# EAGLE design PWMpowctrl (EAGLE 8.6.0)

## Sheet 1 of 2: DRIVERS
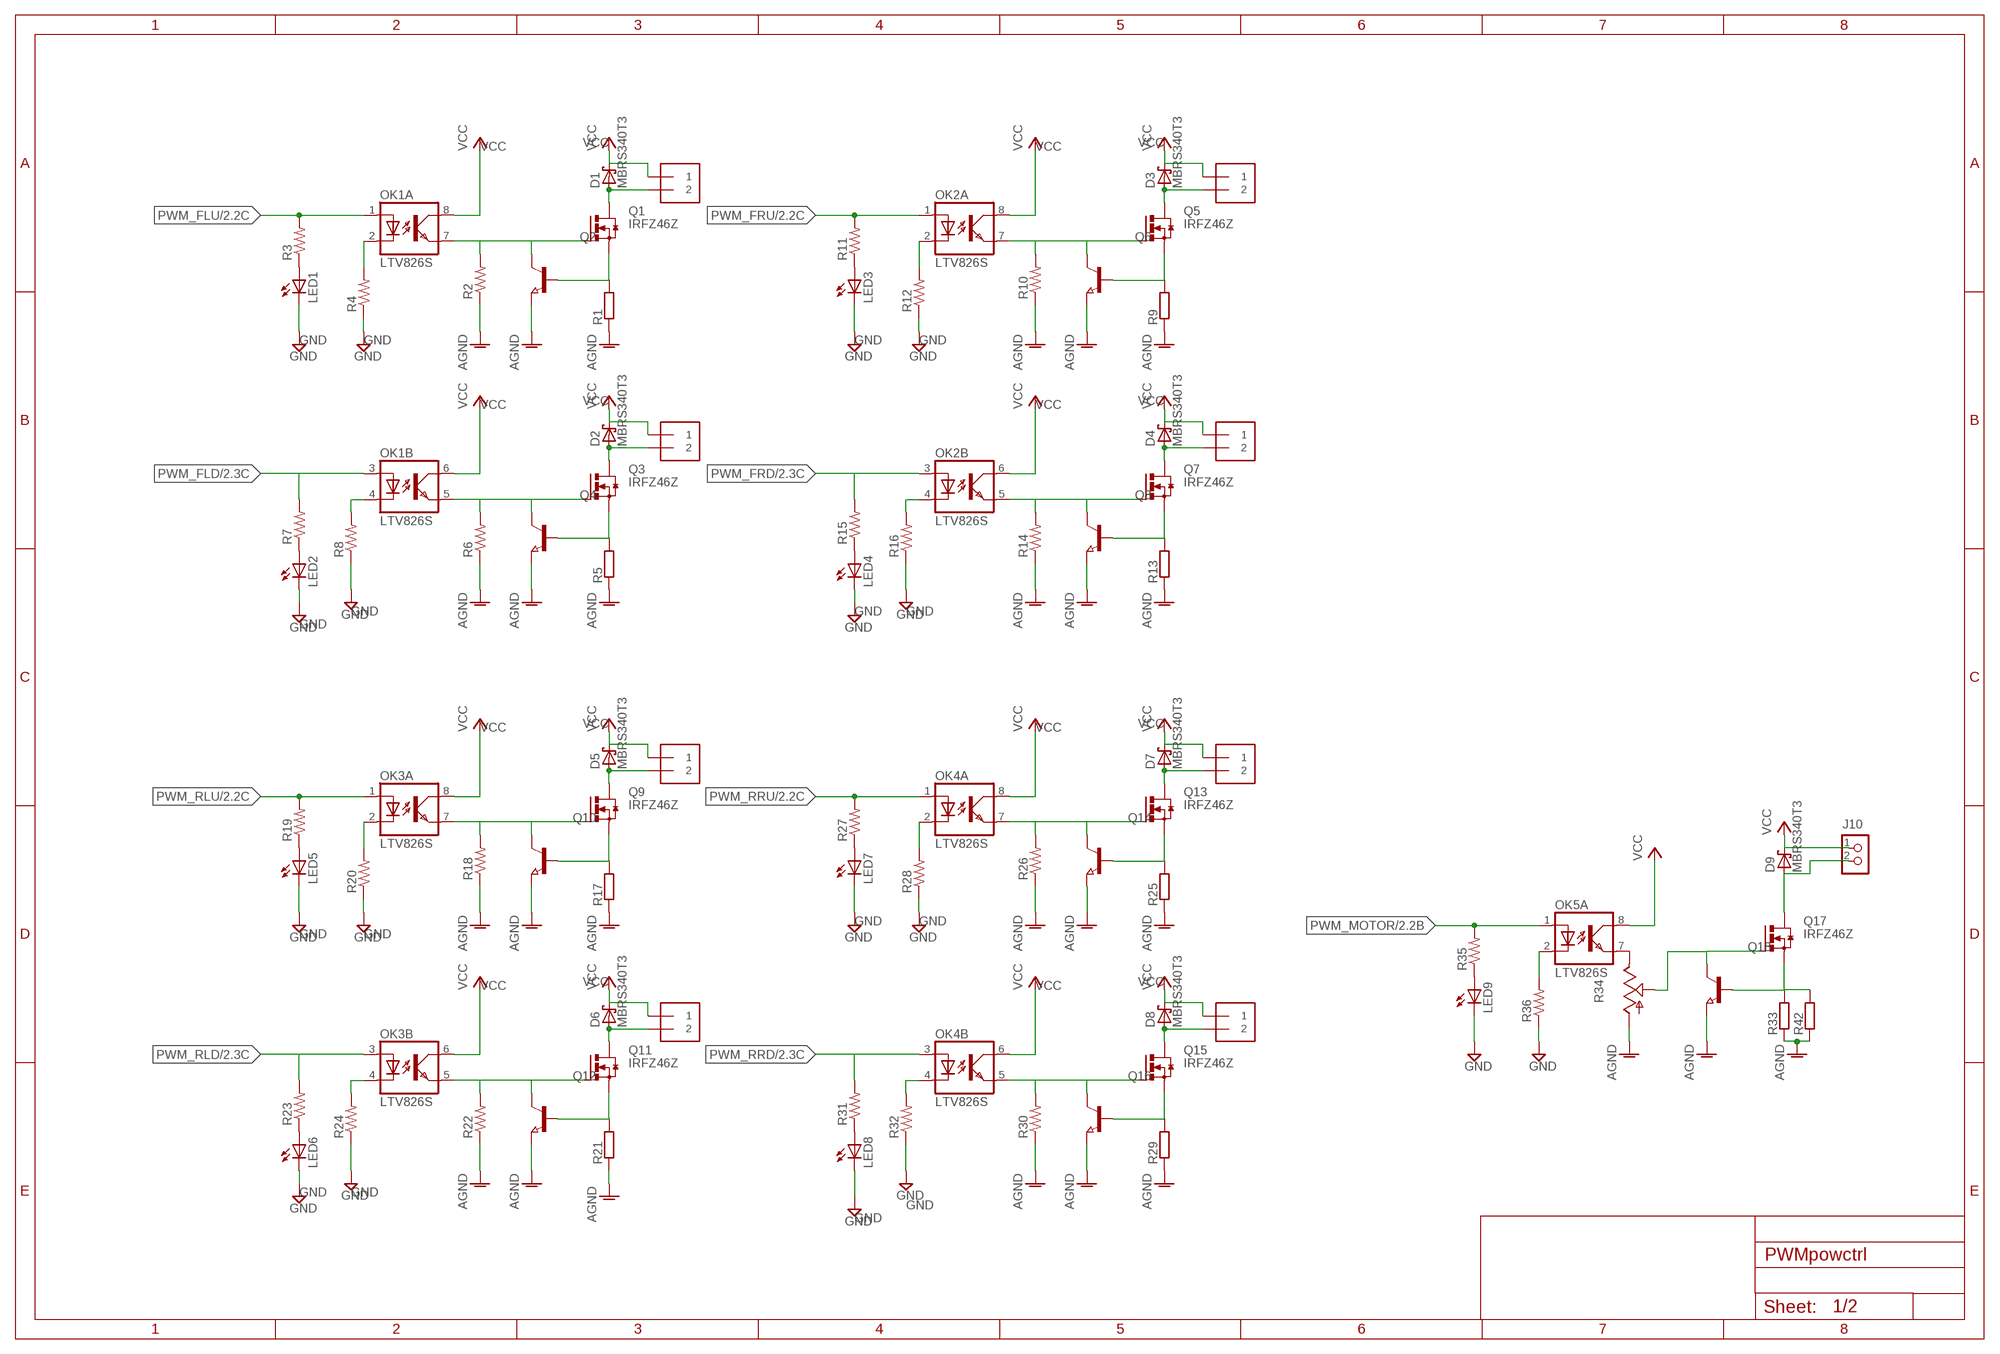
[diagram p0: schematic, sheet 1]

### Parts
D1  MBRS340T3  [SMC]
D2  MBRS340T3  [SMC]
D3  MBRS340T3  [SMC]
D4  MBRS340T3  [SMC]
D5  MBRS340T3  [SMC]
D6  MBRS340T3  [SMC]
D7  MBRS340T3  [SMC]
D8  MBRS340T3  [SMC]
D9  MBRS340T3  [SMC]
J1  1X2-3.5MM  [3.5MMTERM]
J2  1X2-3.5MM  [3.5MMTERM]
J3  1X2-3.5MM  [3.5MMTERM]
J4  1X2-3.5MM  [3.5MMTERM]
J5  1X2-3.5MM  [3.5MMTERM]
J6  1X2-3.5MM  [3.5MMTERM]
J7  1X2-3.5MM  [3.5MMTERM]
J8  1X2-3.5MM  [3.5MMTERM]
J10  CON_TERMINAL_BLOCK_02-5MM  [TERMINAL_BLOCK_2P_5]
LED1  LED3MM  [LED3MM]
LED2  LED3MM  [LED3MM]
LED3  LED3MM  [LED3MM]
LED4  LED3MM  [LED3MM]
LED5  LED3MM  [LED3MM]
LED6  LED3MM  [LED3MM]
LED7  LED3MM  [LED3MM]
LED8  LED3MM  [LED3MM]
LED9  LED3MM  [LED3MM]
OK1  LTV826S  [DIL8-SMD]
OK2  LTV826S  [DIL8-SMD]
OK3  LTV826S  [DIL8-SMD]
OK4  LTV826S  [DIL8-SMD]
OK5  LTV826S  [DIL8-SMD]
Q1  IRFZ46Z  [D2PACK]
Q2  NPN-TRANSISTOR_SOT23  [SOT23]
Q3  IRFZ46Z  [D2PACK]
Q4  NPN-TRANSISTOR_SOT23  [SOT23]
Q5  IRFZ46Z  [D2PACK]
Q6  NPN-TRANSISTOR_SOT23  [SOT23]
Q7  IRFZ46Z  [D2PACK]
Q8  NPN-TRANSISTOR_SOT23  [SOT23]
Q9  IRFZ46Z  [D2PACK]
Q10  NPN-TRANSISTOR_SOT23  [SOT23]
Q11  IRFZ46Z  [D2PACK]
Q12  NPN-TRANSISTOR_SOT23  [SOT23]
Q13  IRFZ46Z  [D2PACK]
Q14  NPN-TRANSISTOR_SOT23  [SOT23]
Q15  IRFZ46Z  [D2PACK]
Q16  NPN-TRANSISTOR_SOT23  [SOT23]
Q17  IRFZ46Z  [D2PACK]
Q18  NPN-TRANSISTOR_SOT23  [SOT23]
R1  BVS  [BVS]
R2  R-US_M1206  [M1206]
R3  R-US_M1206  [M1206]
R4  R-US_M1206  [M1206]
R5  BVS  [BVS]
R6  R-US_M1206  [M1206]
R7  R-US_M1206  [M1206]
R8  R-US_M1206  [M1206]
R9  BVS  [BVS]
R10  R-US_M1206  [M1206]
R11  R-US_M1206  [M1206]
R12  R-US_M1206  [M1206]
R13  BVS  [BVS]
R14  R-US_M1206  [M1206]
R15  R-US_M1206  [M1206]
R16  R-US_M1206  [M1206]
R17  BVS  [BVS]
R18  R-US_M1206  [M1206]
R19  R-US_M1206  [M1206]
R20  R-US_M1206  [M1206]
R21  BVS  [BVS]
R22  R-US_M1206  [M1206]
R23  R-US_M1206  [M1206]
R24  R-US_M1206  [M1206]
R25  BVS  [BVS]
R26  R-US_M1206  [M1206]
R27  R-US_M1206  [M1206]
R28  R-US_M1206  [M1206]
R29  BVS  [BVS]
R30  R-US_M1206  [M1206]
R31  R-US_M1206  [M1206]
R32  R-US_M1206  [M1206]
R33  BVS  [BVS]
R34  TRIM_US-CA6V  [CA6V]
R35  R-US_M1206  [M1206]
R36  R-US_M1206  [M1206]
R42  BVS  [BVS]

### Nets
AGND: Q2.2(E) Q4.2(E) Q6.2(E) Q8.2(E) Q10.2(E) Q12.2(E) Q14.2(E) Q16.2(E) Q18.2(E) R1.2 R2.1 R5.2 R6.1 R9.2 R10.1 R13.2 R14.1 R17.2 R18.1 R21.2 R22.1 R25.2 R26.1 R29.2 R30.1 R33.2 R42.2 ; also sheet 2
GND: LED1.K(C) LED2.K(C) LED3.K(C) LED4.K(C) LED5.K(C) LED6.K(C) LED7.K(C) LED8.K(C) LED9.K(C) R4.1 R8.1 R12.1 R16.1 R20.1 R24.1 R28.1 R32.1 R36.1
N$1: Q1.3(S) Q2.1(B) R1.1
N$2: Q17.3(S) Q18.1(B) R33.1 R42.1
N$3: OK1.2(A:C) R4.2
N$4: Q3.3(S) Q4.1(B) R5.1
N$5: OK1.7(A:EMIT) Q1.1(G) Q2.3(C) R2.2
N$6: D1.A J1.2 Q1.2(D)
N$7: OK1.5(B:EMIT) Q3.1(G) Q4.3(C) R6.2
N$8: LED1.A R3.1
N$9: D2.A J2.2 Q3.2(D)
N$10: LED2.A R7.1
N$11: OK1.4(B:C) R8.2
N$12: Q17.1(G) Q18.3(C) R34.S
N$13: Q5.3(S) Q6.1(B) R9.1
N$14: OK2.7(A:EMIT) Q5.1(G) Q6.3(C) R10.2
N$15: D3.A J3.2 Q5.2(D)
N$16: LED3.A R11.1
N$17: D9.A J10.2 Q17.2(D)
N$18: OK2.2(A:C) R12.2
N$19: Q7.3(S) Q8.1(B) R13.1
N$20: OK2.5(B:EMIT) Q7.1(G) Q8.3(C) R14.2
N$21: D4.A J4.2 Q7.2(D)
N$22: LED4.A R15.1
N$23: OK2.4(B:C) R16.2
N$24: LED9.A R35.1
N$25: Q9.3(S) Q10.1(B) R17.1
N$26: OK3.7(A:EMIT) Q9.1(G) Q10.3(C) R18.2
N$27: D5.A J5.2 Q9.2(D)
N$28: LED5.A R19.1
N$29: OK5.2(A:C) R36.2
N$30: OK3.2(A:C) R20.2
N$31: Q11.3(S) Q12.1(B) R21.1
N$32: OK3.5(B:EMIT) Q11.1(G) Q12.3(C) R22.2
N$33: D6.A J6.2 Q11.2(D)
N$34: LED6.A R23.1
N$35: OK3.4(B:C) R24.2
N$37: Q13.3(S) Q14.1(B) R25.1
N$38: OK4.7(A:EMIT) Q13.1(G) Q14.3(C) R26.2
N$39: D7.A J7.2 Q13.2(D)
N$40: LED7.A R27.1
N$42: OK4.2(A:C) R28.2
N$43: Q15.3(S) Q16.1(B) R29.1
N$44: OK4.5(B:EMIT) Q15.1(G) Q16.3(C) R30.2
N$45: D8.A J8.2 Q15.2(D)
N$46: LED8.A R31.1
N$47: OK4.4(B:C) R32.2
N$53: OK5.7(A:EMIT) R34.E
PWM_FLD: OK1.3(B:A) R7.2 ; also sheet 2
PWM_FLU: OK1.1(A:A) R3.2 ; also sheet 2
PWM_FRD: OK2.3(B:A) R15.2 ; also sheet 2
PWM_FRU: OK2.1(A:A) R11.2 ; also sheet 2
PWM_MOTOR: OK5.1(A:A) R35.2 ; also sheet 2
PWM_RLD: OK3.3(B:A) R23.2 ; also sheet 2
PWM_RLU: OK3.1(A:A) R19.2 ; also sheet 2
PWM_RRD: OK4.3(B:A) R31.2 ; also sheet 2
PWM_RRU: OK4.1(A:A) R27.2 ; also sheet 2
VCC: D1.C D2.C D3.C D4.C D5.C D6.C D7.C D8.C D9.C J1.1 J2.1 J3.1 J4.1 J5.1 J6.1 J7.1 J8.1 J10.1 OK1.6(B:COL) OK1.8(A:COL) OK2.6(B:COL) OK2.8(A:COL) OK3.6(B:COL) OK3.8(A:COL) OK4.6(B:COL) OK4.8(A:COL) OK5.8(A:COL) ; also sheet 2
Unconnected: OK5.3(B:A) OK5.4(B:C) OK5.5(B:EMIT) OK5.6(B:COL) R34.A

## Sheet 2 of 2: INTERFACE & POWER
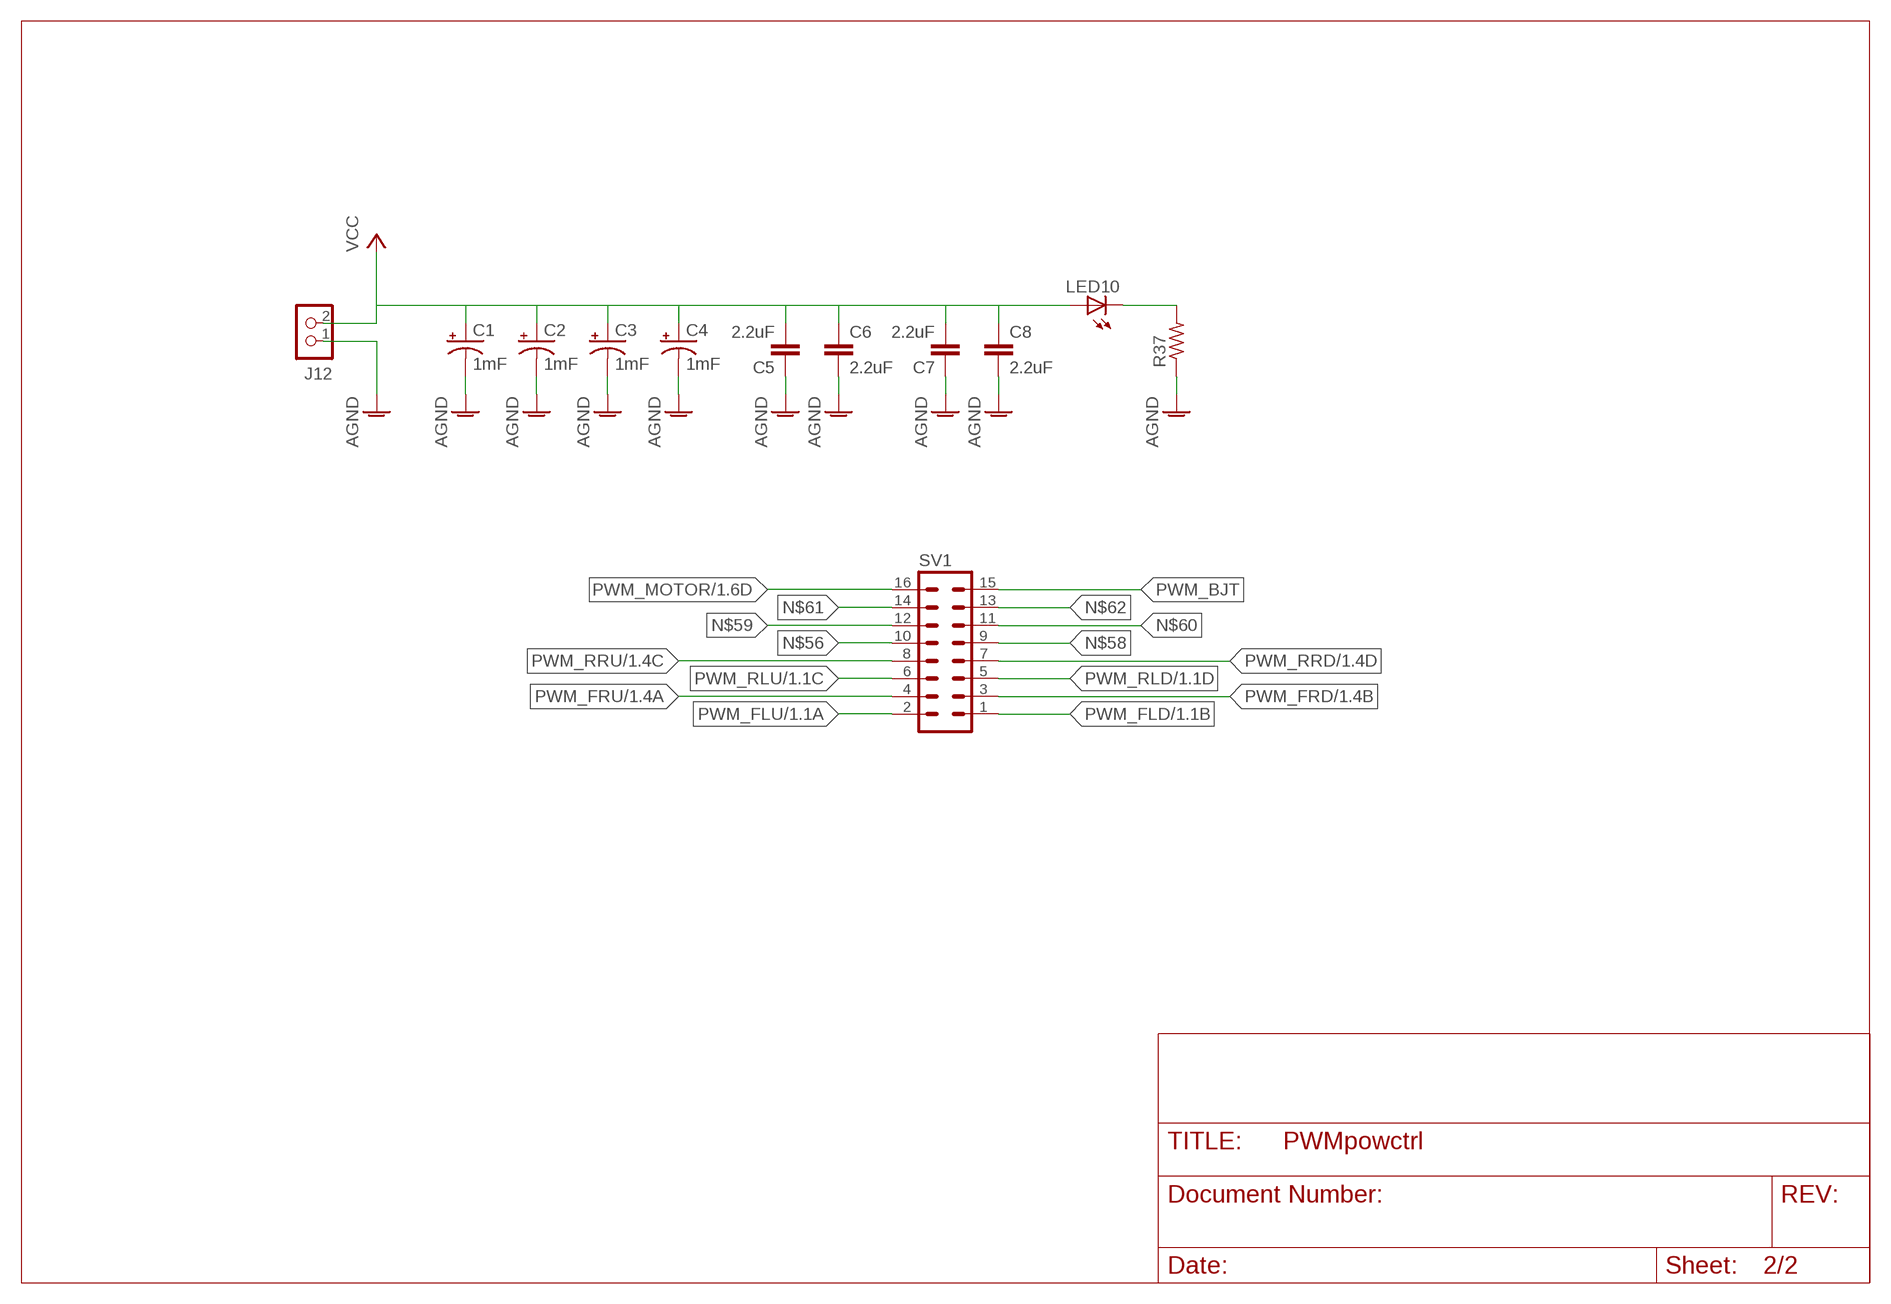
[diagram p1: schematic, sheet 2]

### Parts
C1  1mF  1000UF-RADIAL-5MM-25V-20%  [CPOL-RADIAL-5MM-10MM]
C2  1mF  1000UF-RADIAL-5MM-25V-20%  [CPOL-RADIAL-5MM-10MM]
C3  1mF  1000UF-RADIAL-5MM-25V-20%  [CPOL-RADIAL-5MM-10MM]
C4  1mF  1000UF-RADIAL-5MM-25V-20%  [CPOL-RADIAL-5MM-10MM]
C5  2.2uF  2.2UF-CERCAP-10009  [1206]
C6  2.2uF  2.2UF-CERCAP-10009  [1206]
C7  2.2uF  2.2UF-CERCAP-10009  [1206]
C8  2.2uF  2.2UF-CERCAP-10009  [1206]
J12  CON_TERMINAL_BLOCK_02-5MM  [TERMINAL_BLOCK_2P_5]
LED10  LED5MM  [LED5MM]
R37  R-US_M1206  [M1206]
SV1  MA08-2  [MA08-2]

### Nets
AGND: C1.- C2.- C3.- C4.- C5.1 C6.2 C7.1 C8.2 J12.1 R37.1 ; also sheet 1
N$36: LED10.K(C) R37.2
N$56: SV1.10
N$58: SV1.9
N$59: SV1.12
N$60: SV1.11
N$61: SV1.14
N$62: SV1.13
PWM_BJT: SV1.15
PWM_FLD: SV1.1 ; also sheet 1
PWM_FLU: SV1.2 ; also sheet 1
PWM_FRD: SV1.3 ; also sheet 1
PWM_FRU: SV1.4 ; also sheet 1
PWM_MOTOR: SV1.16 ; also sheet 1
PWM_RLD: SV1.5 ; also sheet 1
PWM_RLU: SV1.6 ; also sheet 1
PWM_RRD: SV1.7 ; also sheet 1
PWM_RRU: SV1.8 ; also sheet 1
VCC: C1.+ C2.+ C3.+ C4.+ C5.2 C6.1 C7.2 C8.1 J12.2 LED10.A ; also sheet 1

## Library data of the parts
C1-C4 = SparkFun-Capacitors:1000UF: 1,000µF/1mF ceramic capacitors A capacitor is a passive two-terminal electrical component used to store electrical energy temporarily in an electric field. CAP-08070; PROD_ID: CAP-09538
C5-C8 = SparkFun-Retired:2.2UF-CER: 2.2uF Ceramic SMT CAP-07888- 10V, 20% (0603) CAP-10009- 50V, 10% (1206); PROD_ID: CAP-10009
D1-D9 = diode:MBRS3*0T3: SCHOTTKY BARRIER RECTIFIER 3.0 AMPERES 20, 30, 40 VOLT Source: MBRS340T3-D.pdf
J1-J8 = adafruit:1X2: 3.5mm Terminal block http://www.ladyada.net/library/pcb/eaglelibrary.html
J10 J12 = dp_devices:CON_TERMINAL_BLOCK_02: 2 poles wire to board terminal block
LED1-LED10 = adafruit:LED: LED OSRAM: - CHIPLED LG R971, LG N971, LY N971, LG Q971, LY Q971, LO R971, LY R971 LH N974, LH R974 LS Q976, LO Q976, LY Q976 LO Q996 - Hyper CHIPLED LW Q18S LB Q993, LB Q99A, LB R99A - SideLED LS A670, LO A670, LY A670, LG A670, LP A670 LB A673, LV A673, LT A673, LW A673 LH A674 LY A675 LS A676, LA A676, LO A676, LY A676, LW A676 LS A679, LY A679, LG A679 - Hyper Micro SIDELED® LS Y876, LA Y876, LO Y876, LY Y876 LT Y87S - SmartLED LW L88C, LW L88S LB L89C, LB L89S, LG L890 LS L89K, LO L89K, LY L89K LS L896, LA L896, LO L896, LY L896 - TOPLED LS T670, LO T670, LY T670, LG T670, LP T670 LSG T670, LSP T670, LSY T670, LOP T670, LYG T670 LG T671, LOG T671, LSG T671 LB T673, LV T673, LT T673, LW T673 LH T674 LS T676, LA T676, LO T676, LY T676, LB T676, LH T676, LSB T676, LW T676 LB T67C, LV T67C, LT T67C, LS T67K, LO T67K, LY T67K, LW E67C LS E67B, LA E67B, LO E67B, LY E67B, LB E67C, LV E67C, LT E67C LW T67C LS T679, LY T679, LG T679 LS T770, LO T770, LY T770, LG T770, LP T770 LB T773, LV T773, LT T773, LW T773 LH T774 LS E675, LA E675, LY E675, LS T675 LS T776, LA T776, LO T776, LY T776, LB T776 LHGB T686 LT T68C, LB T68C - Hyper Mini TOPLED® LB M676 - Mini TOPLED Santana® LG M470 LS M47K, LO M47K, LY M47K Source: http://www.osram.convergy.de/
OK1-OK5 = optocoupler:LTV826: OPTO COUPLER Source: LITEON, LTV816.pdf; OC_FARNELL: unknown; OC_NEWARK: unknown
Q1 Q3 Q5 Q7 Q9 Q11 Q13 Q15 Q17 = transistor-power:IRFZ46Z: AUTOMOTIVE MOSFET Vdss=55V RDSon=13 mOhm ID=51 A
Q2 Q4 Q6 Q8 Q10 Q12 Q14 Q16 Q18 = semicon-smd-ipc:NPN-TRANSISTOR_: NPN TRANSISTOR
R1 R5 R9 R13 R17 R21 R25 R29 R33 R42 = resistor-shunt:BVS: SMD SHUNT RESISTOR; OC_FARNELL: unknown; OC_NEWARK: unknown
R2-R4 R6-R8 R10-R12 R14-R16 R18-R20 R22-R24 R26-R28 R30-R32 R35-R37 = adafruit:R-US_: RESISTOR, American symbol
R34 = pot:TRIM_US-: POTENTIOMETER
SV1 = con-lstb:MA08-2: PIN HEADER; OC_FARNELL: unknown; OC_NEWARK: unknown

## Board
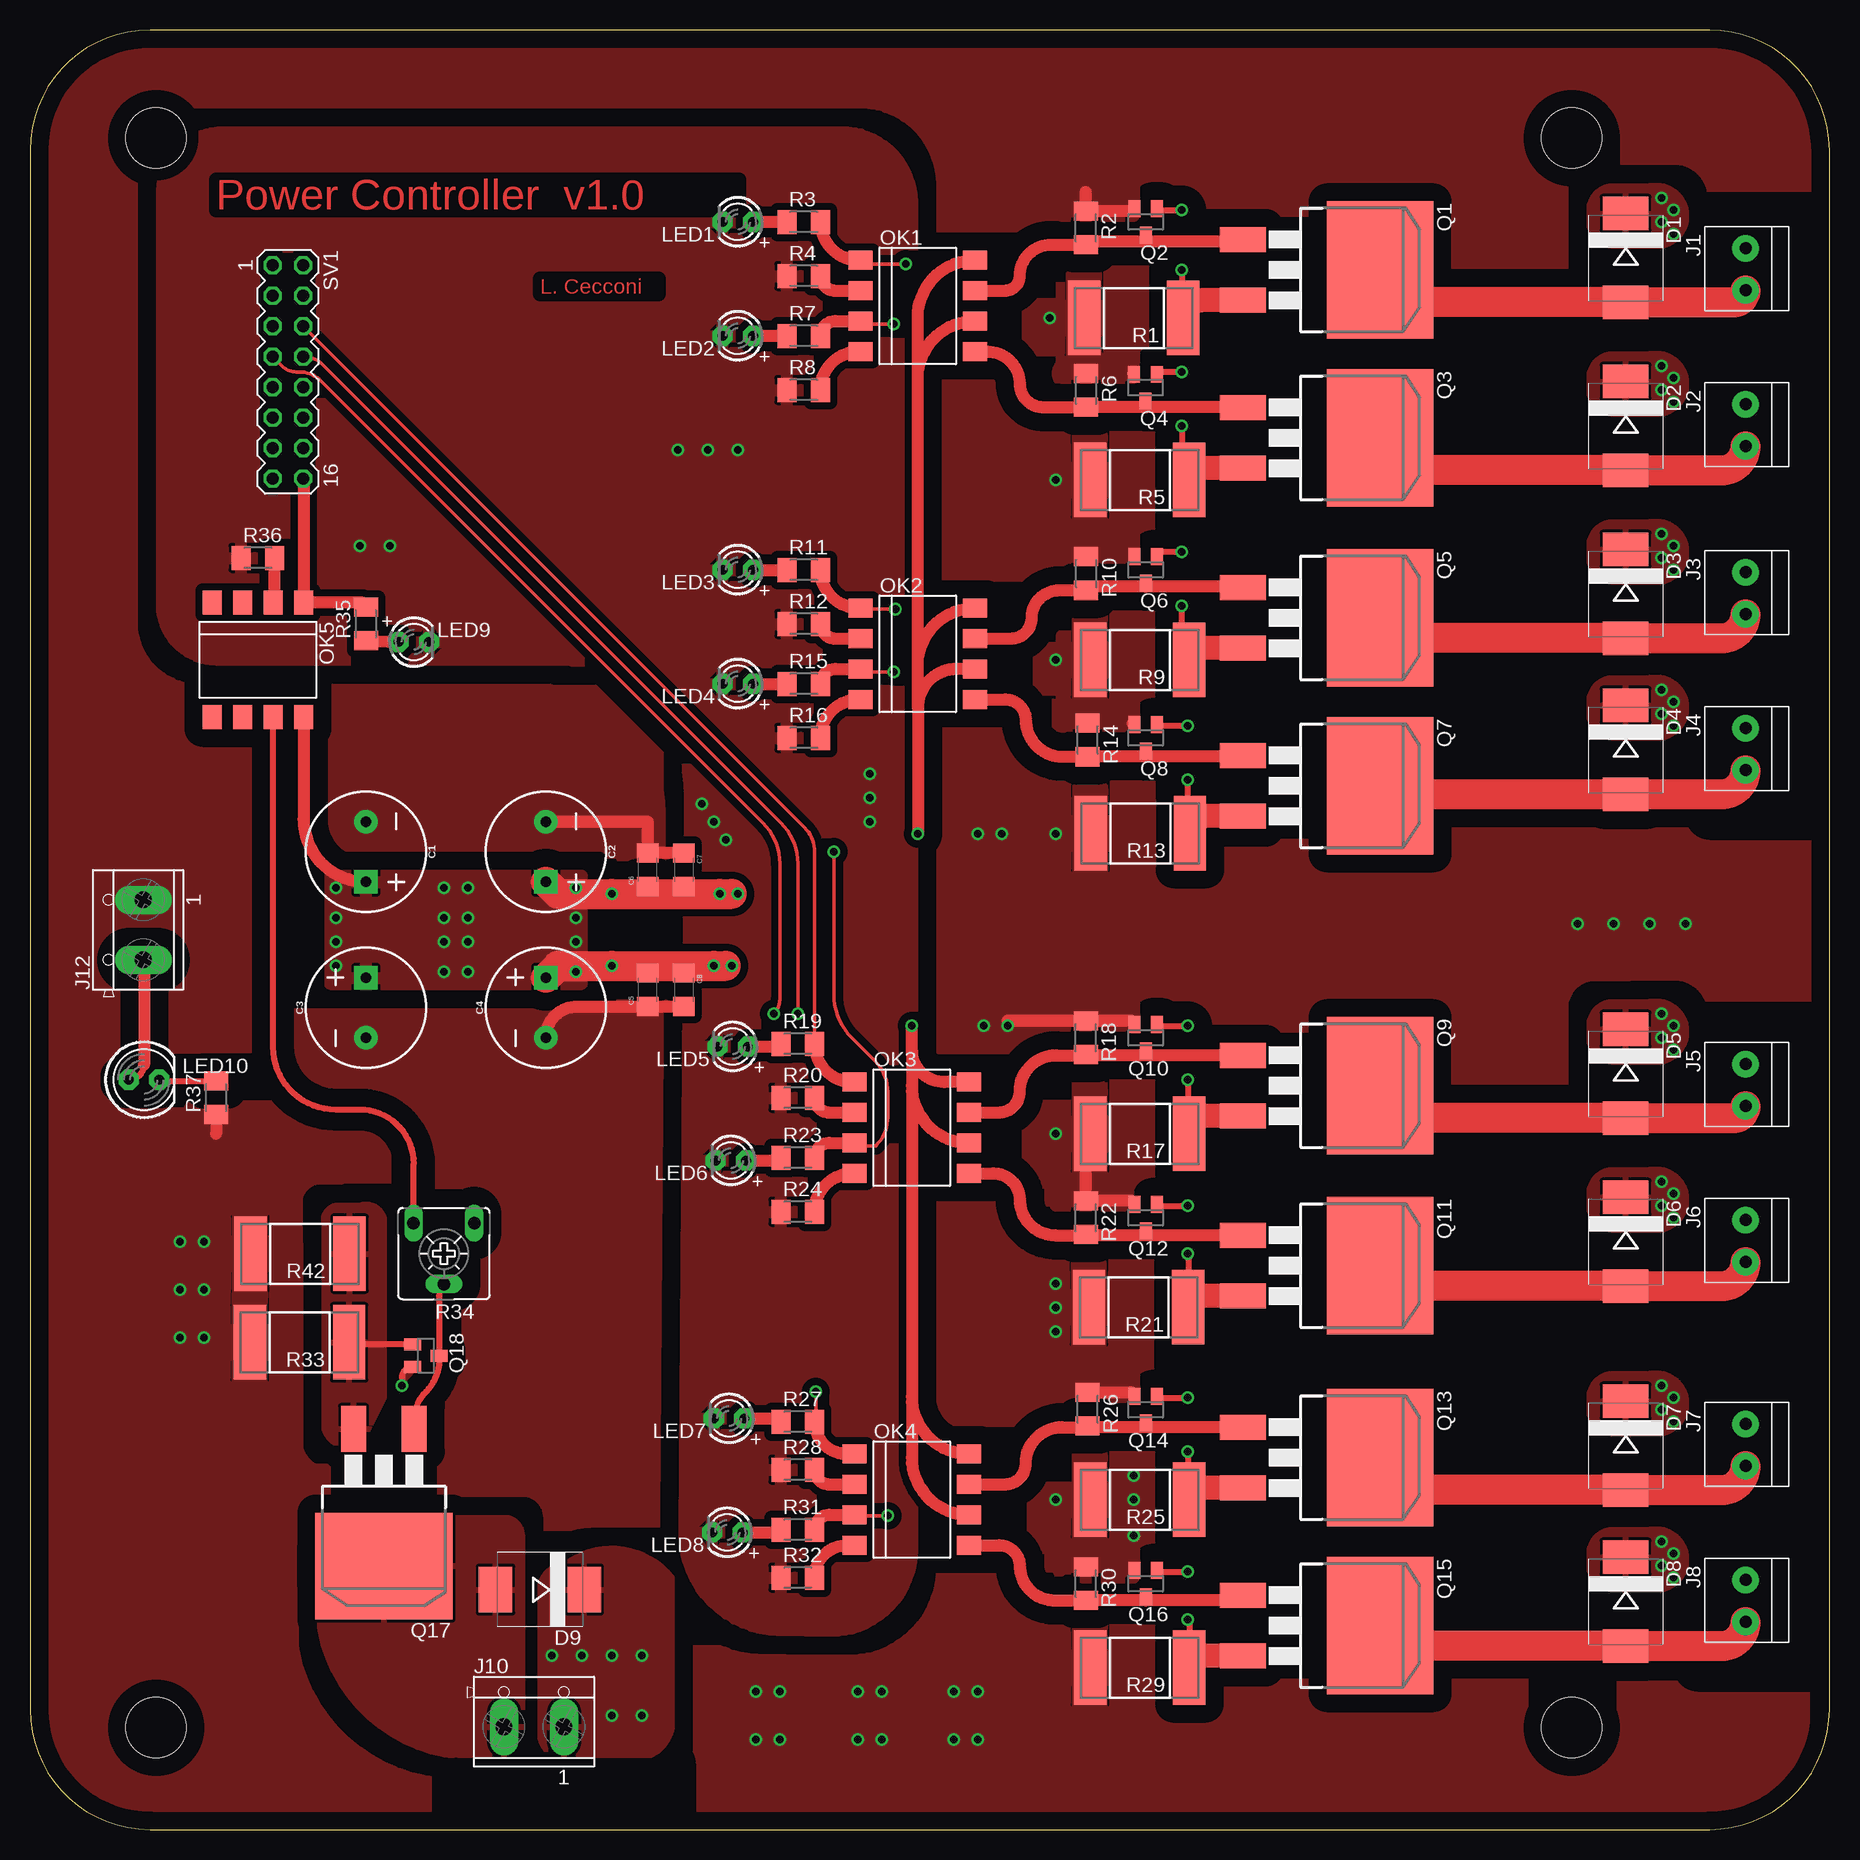
[diagram p2: board, top side]
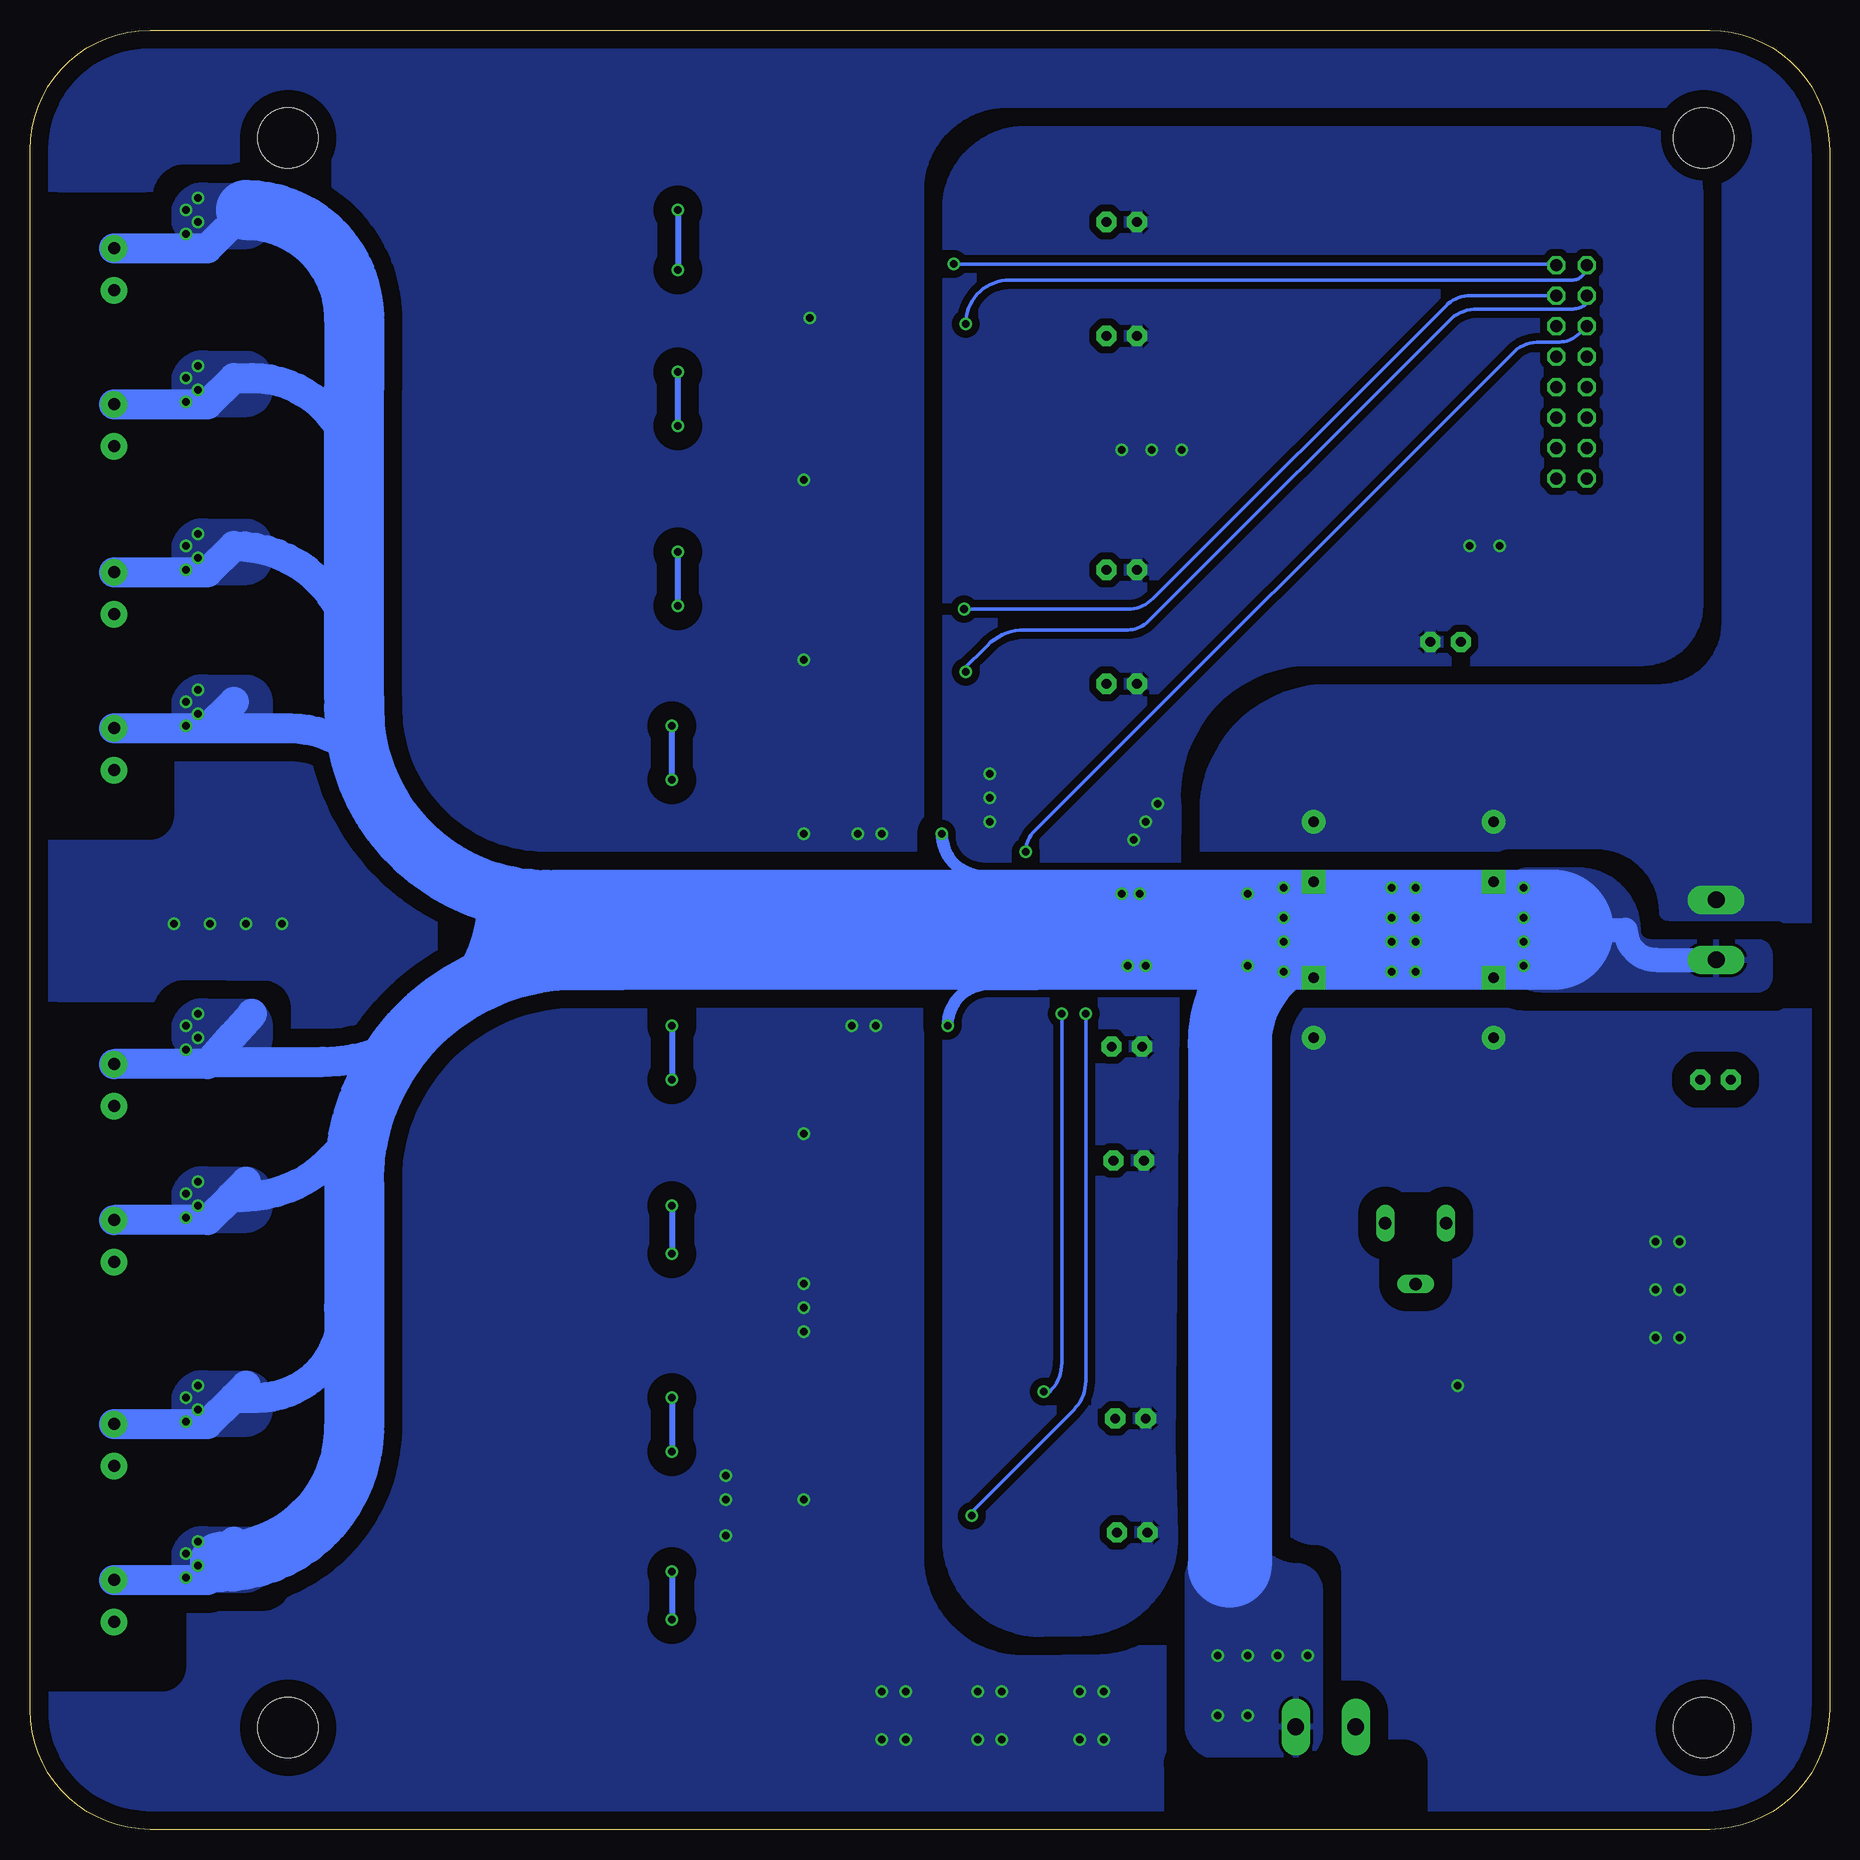
[diagram p3: board, bottom side, seen from below]

Size 150 x 150 mm. Coordinates in mm from the lower left corner, seen from the top.
Outline: 0,140 0,10 arc90 10,0 140,0 arc90 150,10 150,140 arc90 140,150 10,150 arc90 0,140
Copper layers (1*16): Top 0.035mm / dielectric 1.5mm / Bottom 0.035mm
Design rules "default": minimum track width 6mil, minimum drill 0.35mm, track to track 6mil, track to pad 6mil, pad to pad 6mil, via to via 6mil, smd to smd 6mil, copper to edge 40mil, drill to drill 6mil, minimum pad ring 10mil, minimum via ring 8mil, stop-mask expansion 4mil, vias tented up to drill 0mil, thermal gap 10mil
Holes 5 mm at 10.5,8.5 128.5,8.5 10.5,141 128.5,141
tRestrict: area 140,84.5 to 148,134.5; area 139,13.5 to 148,67; area 35.5,-0.5 to 53.5,5.5
bRestrict: area 140,84.5 to 148,134.5; area 139,13.5 to 148,67; area 35.5,-0.5 to 53.5,5.5

### Footprints (pad centres in the part's own frame; a part is rotated, then mirrored left to right if it is on the bottom)
CPOL-RADIAL-5MM-10MM = drill 0.9 pad 1.93 square: + 2.5,0 | drill 0.9 pad 1.93: - -2.5,0
1206 = smd 1.6 x 1.8: 1 -1.4,0; 2 1.4,0
SMC = smd 2.8 x 3.8: A 3.7,0; C -3.7,0
3.5MMTERM = drill 1 pad 2.184: 1 1.8,0; 2 -1.7,0
TERMINAL_BLOCK_2P_5 = drill 1.4 pad 2.38 long: 1 2.5,-0.45; 2 -2.5,-0.45
LED3MM = drill 0.813 pad 1.676 octagon: A -1.27,0; K 1.27,0
LED5MM = drill 0.813 pad 1.676 octagon: A -1.27,0; K 1.27,0
DIL8-SMD = smd 1.6 x 2: 1 -3.81,-4.77; 2 -1.27,-4.77; 3 1.27,-4.77; 4 3.81,-4.77; 5 3.81,4.77; 6 1.27,4.77; 7 -1.27,4.77; 8 -3.81,4.77
D2PACK = smd 2.083 x 3.81: 1 -2.54,-8.89; 3 2.54,-8.89 | smd 11.43 x 8.89: 2 0,2.54
SOT23 = smd 1 x 1.4: 1 -0.95,-1.1; 2 0.95,-1.1; 3 0,1.1
BVS = smd 2.7 x 6.2: 1 -4.14,0; 2 4.14,0
M1206 = smd 1.6 x 2: 1 -1.4,0; 2 1.4,0
CA6V = drill 1.016 long: A -2.54,-2.54; E 2.54,-2.54; S 0,2.54
MA08-2 = drill 1.016 octagon: 1 -8.89,-1.27; 2 -8.89,1.27; 3 -6.35,-1.27; 4 -6.35,1.27; 5 -3.81,-1.27; 6 -3.81,1.27; 7 -1.27,-1.27; 8 -1.27,1.27; 9 1.27,-1.27; 10 1.27,1.27; 11 3.81,-1.27; 12 3.81,1.27; 13 6.35,-1.27; 14 6.35,1.27; 15 8.89,-1.27; 16 8.89,1.27

### Placement (x,y rotation side)
C1  28,81.5 270 top
C2  43,81.5 270 top
C3  28,68.5 90 top
C4  43,68.5 90 top
C5  51.5,70 90 top
C6  51.5,80 90 top
C7  54.5,80 270 top
C8  54.5,70 270 top
D1  133,131 270 top
D2  133,117 270 top
D3  133,103 270 top
D4  133,90 270 top
D5  133,63 270 top
D6  133,49 270 top
D7  133,32 270 top
D8  133,19 270 top
D9  42.5,20 180 top
J1  143,130 90 top
J2  143,117 90 top
J3  143,103 90 top
J4  143,90 90 top
J5  143,62 90 top
J6  143,49 90 top
J7  143,32 90 top
J8  143,19 90 top
J10  42,9 0 top
J12  9,75 90 top
LED1  59,134 180 top
LED2  59,124.5 180 top
LED3  59,105 180 top
LED4  59,95.5 180 top
LED5  58.57,65.26 180 top
LED6  58.42,55.76 180 top
LED7  58.27,34.26 180 top
LED8  58.12,24.76 180 top
LED9  32,98.99 0 top
LED10  9.5,62.5 0 top
OK1  74,127 270 top
OK2  74,98 270 top
OK3  73.5,58.5 270 top
OK4  73.5,27.5 270 top
OK5  19,97.5 180 top
Q1  110,130 270 top
Q2  93,134 180 top
Q3  110,116 270 top
Q4  92.98,120.19 180 top
Q5  110,101 270 top
Q6  93,105 180 top
Q7  110,87 270 top
Q8  93,91 180 top
Q9  110,62 270 top
Q10  93,66 180 top
Q11  110,47 270 top
Q12  93,51 180 top
Q13  110,31 270 top
Q14  93,35 180 top
Q15  110,17 270 top
Q16  93,20.5 180 top
Q17  29.5,24.5 180 top
Q18  33,39.5 270 top
R1  92,126 180 top
R2  88,133.5 270 top
R3  64.5,134 0 top
R4  64.5,129.5 0 top
R5  92.5,112.5 180 top
R6  88.04,119.96 270 top
R7  64.5,124.5 0 top
R8  64.5,120 0 top
R9  92.5,97.5 180 top
R10  88.04,104.7 270 top
R11  64.5,105 0 top
R12  64.5,100.5 0 top
R13  92.55,83.04 180 top
R14  88.16,90.82 270 top
R15  64.5,95.5 0 top
R16  64.5,91 0 top
R17  92.5,58 180 top
R18  88,66 270 top
R19  64,65.5 0 top
R20  64,61 0 top
R21  92.41,43.54 180 top
R22  88,51 270 top
R23  64,56 0 top
R24  64,51.5 0 top
R25  92.5,27.5 180 top
R26  88.16,35.04 270 top
R27  64,34 0 top
R28  64,30 0 top
R29  92.5,13.5 180 top
R30  88,20.5 270 top
R31  64,25 0 top
R32  64,21 0 top
R33  22.46,40.61 180 top
R34  34.5,48 180 top
R35  28,100.5 90 top
R36  19,106 0 top
R37  15.5,61 90 top
R42  22.5,48 180 top
SV1  21.5,121.5 270 top

### Tracks (layer width: path | path; a pad name or v marks a point on that pad's centre or on a via)
AGND  (via drill 0.65)
  Top 0.5: Q18.2 arc90 31,37.65 v31,37
  Top 1: R37.1 15.5,58 | C4.- arc-90 45.6,68.6 C5.1 C8.2 | v92,24.5 arc-90 92.05,24.45 | R26.1 91.71,36.44 arc-90 Q14.2 | Q12.2 arc90 91.75,52.4 R22.1 88,58 R17.2 | Q10.2 arc90 91.75,67.4 R18.1 81.5,67.4 v81.5,67 | Q8.2 arc90 91.93,92.22 | Q4.2 arc90 91.96,121.36 | Q2.2 arc-90 91.85,134.9 R2.1 88,136.5 | 88.16,97.5 R9.2 | 88.04,112.5 R5.2 | 88.04,126 R1.2 | C7.1 C6.2 51.5,84 C2.- | 88,21.6 R30.1
  other vias: 12.5,49 14.5,49 12.5,45 14.5,45 12.5,41 14.5,41 60.5,11.5 62.5,11.5 60.5,7.5 62.5,7.5 69,11.5 71,11.5 69,7.5 71,7.5 77,11.5 79,11.5 77,7.5 79,7.5 85.5,27.5 92,29.5 92,27.5 129,75.5 132,75.5 135,75.5 138,75.5 85.5,43.5 85.5,58 85.5,97.5 85.5,112.5 85,126 85.5,83 79.5,67 79,83 81,83 85.5,45.5 85.5,41.5
  pour Top (isolate 1.5, rank 2): -1,150 arc135 -1.5,149.79 -1.5,7.17 arc90 5.67,-0.02 144.02,-0.48 arc90 151.5,6.98 151.5,139.5 arc90 141,150
  pour Bottom (isolate 1.5, rank 2): 140.76,150.5 8,150.5 arc90 -0.5,142 -0.5,0.5 152.5,0 152.5,138.76 arc90
  pour Top: 86,44 92,44 92,36.5 86,36.5
  pour Top: 86,44 92,44 92,36.5 86,36.5
  pour Top: 85.5,27.5 92,27.5 92,21 88,21 arc-90 85.5,23.5
  pour Top: 85.5,59.5 91.5,59.5 91.5,52 85.5,52
  pour Top: 86,74.5 92,74.5 92,67 86,67
  pour Top: 86,99.5 92,99.5 92,92 86,92
  pour Top: 86,114 92,114 92,106 86,106
  pour Top: 86,129 92,129 92,121 86,121
  pour Top: 86,142.5 92,142.5 92,134.5 86,134.5
GND  (via drill 0.65)
  other vias: 58,82.5 57,84 56,85.5 70,88 70,86 70,84 54,115 56.5,115 59,115 27.5,107 30,107
  pour Top (isolate 0.6): 44.17,97.5 15.58,97.5 arc-90 11,102.08 11,136.38 arc-90 16.12,141.5 67.63,141.5 arc-90 73.5,135.63 73.5,23.31 arc-91 66.61,16.53 62.46,16.6 arc-89 54.56,24.69 55,86.17 arc90
  pour Bottom (isolate 0.6): 44.17,97.5 15.58,97.5 arc-90 11,102.08 11,136.38 arc-90 16.12,141.5 67.05,141.5 arc-90 73.5,135.05 73.5,24.31 arc-91 65.61,16.54 62.46,16.6 arc-91 54.76,24.68 55,32 54.5,85.17 arc90
N$1  (via drill 0.65)
  Top 0.5: Q2.1 94.05,135 v96,135 | v96,130 96,126.14 R1.1
  Top 2: Q1.3 97.6,127.46 arc90 R1.1
  Bottom 0.5: v96,135 v96,130
N$2
  Top 0.5: Q18.1 26.99,40.45 arc-45 R33.1
  pour Top: 29.5,36 29.5,51 arc90 27.5,52 25.5,52 arc90 24.5,50.5 24.5,33.5 arc90 27,32 arc90 28,33
N$3
  Top 1: R4.2 arc90 67.13,128.27 OK1.2
N$4  (via drill 0.65)
  Top 0.5: v96,121.5 94.14,121.5 Q4.1 | R5.1 96.64,112.86 96,113.5 v96,117
  Top 2: Q3.3 97.6,113.46 arc90 R5.1
  Bottom 0.5: v96,117 v96,121.5
N$5
  Top 0.5: 101.25,132.4 Q1.1 | 87.8,132.4 R2.2
  Top 1: 93,132.4 88.3,132.4 arc90 R2.2 85.1,132.1 arc90 82.5,129.5 arc-90 81.27,128.27 OK1.7 | 93,132.4 101.25,132.4 | Q2.3 93,132.4
N$6
  Top 2.5: Q1.2 arc90 114.24,127.3 D1.A 142,127.3 arc90 J1.2
N$7
  Top 0.5: 101.07,118.5 Q3.1 | 88.57,118.59 R6.2
  Top 1: Q3.1 arc90 101.09,118.56 93,118.56 | 93,118.56 R6.2 84.44,118.56 arc-90 82.5,120.5 arc90 79.81,123.19 OK1.5 | Q4.3 arc-90 93,119.07 93,118.56
N$8
  Top 1: R3.1 LED1.A
N$9
  Top 2.5: Q3.2 arc90 114.24,113.3 D2.A 141,113.3 arc90 J2.2
N$10
  Top 1: R7.1 LED2.A
N$11
  Top 1: R8.2 arc-90 69.09,123.19 OK1.4
N$12
  Top 0.5: R34.S arc45 34.1,44.49 Q18.3 34.1,39.16 arc-45 33,36.5 arc45 32.04,34.18 Q17.1
N$13  (via drill 0.65)
  Top 0.5: R9.1 96.64,98.5 96,98.5 v96,102 | v96,106.5 94.01,106.5 Q6.1
  Top 2: Q5.3 97.6,98.46 arc90 R9.1
  Bottom 0.5: v96,102 v96,106.5
N$14
  Top 0.5: 88.33,103.59 R10.2
  Top 1: Q5.1 arc90 101.06,103.59 93,103.59 | 93,103.59 88.33,103.59 | Q6.3 93,103.59 | OK2.7 81.77,99.27 arc90 83.5,101 arc-90 85.8,103.3 R10.2
N$15
  Top 2.5: Q5.2 arc90 114.24,99.3 D3.A 141,99.3 arc90 J3.2
N$16
  Top 1: LED3.A R11.1
N$17
  pour Top: 26,25.5 arc-90 26.5,26 34.5,26 35,26 38,26 38.5,26 39.5,26 arc-90 41,24.5 41,8 41,7.5 arc-90 39.5,6 37,6 arc-90 24,19 24,23.5 arc-90
N$18
  Top 1: R12.2 arc90 67.13,99.27 OK2.2
N$19  (via drill 0.65)
  Top 0.5: R13.1 96.5,83.04 v96.5,87.5 | v96.5,92 93.95,92 Q8.1
  Top 2: Q7.3 97.92,84.46 arc90 96.5,83.04
  Bottom 0.5: v96.5,87.5 v96.5,92
N$20
  Top 0.5: Q7.1 101.11,89.4 | 88.16,89.4 R14.2
  Top 1: 101.11,89.4 arc90 101.09,89.42 93,89.42 | 93,89.42 R14.2 86.08,89.42 arc-90 83,92.5 arc90 81.31,94.19 OK2.5 | Q8.3 93,89.42
N$21
  Top 2.5: Q7.2 113.33,86.68 arc22 115.23,86.3 D4.A 141,86.3 arc90 J4.2
N$22
  Top 1: LED4.A R15.1
N$23
  Top 1: R16.2 arc-90 69.09,94.19 OK2.4
N$24
  Top 1: R35.1 LED9.A
N$25  (via drill 0.65)
  Top 0.5: Q10.1 arc90 94.05,67 v96.5,67 | v96.5,62.5 96.5,59 96.5,58.14 arc90 R17.1
  Top 2: Q9.3 96.96,59.46 arc90 96.5,59
  Bottom 0.5: v96.5,67 v96.5,62.5
N$26
  Top 1: Q9.1 93.36,64.54 | 93.36,64.54 88.06,64.54 | 88.06,64.54 arc-90 R18.2 | 93.36,64.54 arc-90 Q10.3 | OK3.7 80.77,59.77 arc90 82.5,61.5 arc-90 85.54,64.54 88.06,64.54
N$27
  Top 2.5: Q9.2 arc-90 113,61.54 113,61 arc90 115.7,59.3 D5.A 142,59.3 arc90 J5.2
N$28
  Top 1: LED5.A 62.36,65.26 arc90 R19.1
N$29
  Top 1: OK5.2 arc90 20.4,102.4 R36.2
N$30
  Top 1: R20.2 arc90 66.63,59.77 OK3.2
N$31  (via drill 0.65)
  Top 0.5: Q12.1 arc90 94.05,52 v96.5,52 | v96.5,48 arc-90 96.55,47.95 96.55,44 R21.1
  Top 2: Q11.3 97.01,44.46 arc90 96.55,44
  Bottom 0.5: v96.5,52 v96.5,48
N$32
  Top 1: Q11.1 93,49.54 | 93,49.54 88.06,49.54 | 88.06,49.54 arc-90 R22.2 | Q12.3 93,49.54 | OK3.5 80.31,54.69 arc-90 82.5,52.5 arc90 85.46,49.54 88.06,49.54
N$33
  Top 2.5: Q11.2 arc90 115.24,45.3 D6.A 141,45.3 arc90 J6.2
N$34
  Top 1: LED6.A 62.36,55.76 arc90 R23.1
N$35
  Top 1: R24.2 arc-90 68.59,54.69 OK3.4
N$36
  Top 0.5: LED10.K arc90 10.87,62.4 R37.2
N$37  (via drill 0.65)
  Top 0.5: Q14.1 arc90 94.05,36 v96.5,36 | v96.5,31.5 96.5,27.64 arc90 R25.1
  Top 2: Q13.3 97.6,28.46 arc90 R25.1
  Bottom 0.5: v96.5,36 v96.5,31.5
N$38
  Top 1: Q13.1 93,33.54 | 93,33.54 88.26,33.54 | 88.26,33.54 arc-90 R26.2 | Q14.3 93,33.54 | OK4.7 81.27,28.77 arc90 83,30.5 arc-90 86.04,33.54 88.26,33.54
N$39
  Top 2.5: Q13.2 113,31 arc90 115.7,28.3 D7.A 141,28.3 arc90 J7.2
N$40
  Top 1: LED7.A 62.34,34.26 arc-90 R27.1
N$42
  Top 1: R28.2 arc90 66.63,28.77 OK4.2
N$43  (via drill 0.65)
  Top 0.5: Q16.1 arc90 94.05,21.5 v96.5,21.5 | v96.5,17.5 arc-90 96.64,17.36 R29.1
  Top 2: Q15.3 97.6,14.46 arc90 R29.1
  Bottom 0.5: v96.5,21.5 v96.5,17.5
N$44
  Top 1: Q15.1 arc-90 100.67,19.1 93,19.1 | 93,19.1 R30.2 85.4,19.1 arc-90 82.5,22 arc90 80.81,23.69 OK4.5 | Q16.3 93,19.1
N$45
  Top 2.5: Q15.2 arc90 114.24,15.3 D8.A 141,15.3 arc90 J8.2
N$46
  Top 1: LED8.A 62.36,24.76 arc90 R31.1
N$47
  Top 1: R32.2 arc-90 68.09,23.69 OK4.4
N$53
  Top 0.5: R34.E 31.96,55.4 arc-45 32,55.5 arc90 27.5,60 25.5,60 arc-90 20.27,65.23 OK5.7
PWM_FLD  (via drill 0.65)
  Top 0.3: v72,125.5 69.46,125.5 arc-90 OK1.3
  Top 1: R7.2 arc-90 67.13,125.73 OK1.3
  Bottom 0.3: SV1.1 arc90 21.46,129.16 68.34,129.16 arc-90 v72,125.5
PWM_FLU  (via drill 0.65)
  Top 0.3: v73,130.5 69.09,130.5 69.09,130.81
  Top 1: R3.2 arc90 69.09,130.81 OK1.1
  Bottom 0.3: 22.88,130.5 v73,130.5
  Bottom 0.5: SV1.2 arc-90 22.88,130.5
PWM_FRD  (via drill 0.65)
  Top 0.3: v72,96.5 69.46,96.5 OK2.3
  Top 1: R15.2 arc-90 67.13,96.73 OK2.3
  Bottom 0.3: SV1.3 20.23,127.22 arc45 21.37,126.75 29.34,126.75 arc-45 31.75,125.75 56.79,100.71 arc45 58.5,100 67.08,100 arc-45 70.2,98.7 72.26,96.65 72.15,96.65 v72,96.5
PWM_FRU  (via drill 0.65)
  Top 0.3: v72.14,101.73 69.31,101.73 OK2.1
  Top 1: OK2.1 69.09,101.81 arc-90 R11.2
  Bottom 0.3: SV1.4 29.95,127.85 arc-45 32,127 56.41,102.59 arc45 58.5,101.73 v72.14,101.73
PWM_MOTOR
  Top 1: R35.2 arc90 27.63,102.27 OK5.1 22.81,112.57 arc90 SV1.16
PWM_RLD  (via drill 0.65)
  Top 0.3: v67,81.5 67,69.62 arc45 68.5,66 70.44,64.06 arc-45 71.5,61.5 71.5,59.41 arc-45 70.5,57 68.96,57 OK3.3
  Top 1: R23.2 arc-90 66.63,57.23 OK3.3
  Bottom 0.3: SV1.5 20.86,124.68 arc45 22.5,124 24.09,124 arc-45 26.5,123 66.29,83.21 arc-45 v67,81.5
PWM_RLU
  Top 0.3: SV1.6 64.57,83.51 arc-45 65.4,81.5 R19.2
  Top 1: R19.2 arc90 68.59,62.31 OK3.1
PWM_RRD  (via drill 0.65)
  Top 0.3: SV1.7 21,122 arc45 22.21,121.5 22.44,121.5 arc-45 24.25,120.75 61.09,83.91 arc-45 62.5,80.5 62.5,69.21 arc-45 v62,68 | v71.5,26.16 68.8,26.16 OK4.3
  Top 1: R31.2 arc-90 66.63,26.23 OK4.3
  Bottom 0.3: v62,68 62,37.41 arc45 63,35 71.5,26.5 v71.5,26.16
PWM_RRU  (via drill 0.65)
  Top 0.3: SV1.8 arc-45 24.41,122.09 62.59,83.91 arc-45 64,80.5 v64,68 | v65.5,36.5 65.5,34.1 R27.2
  Top 1: R27.2 arc90 68.09,31.31 OK4.1
  Bottom 0.3: v64,68 64,38.91 arc45 65,36.5 v65.5,36.5
VCC  (via drill 0.65)
  Top 0.5: J12.2 arc-90 9.5,72.45 | 9.5,63.77 arc-90 LED10.A | v58.5,72 v57,72 | v59,78 v57.5,78
  Top 1: OK3.8 76.19,62.31 arc-90 73.5,65 | 73.5,65 v73.5,67 | 73.5,65 73.5,62 | 73.5,62 arc90 OK3.6 | 73.5,62 73.5,36.08 | 73.5,36.08 arc90 OK4.8 | 73.5,36.08 73.5,31 arc90 OK4.6 | OK2.6 77.23,96.73 arc90 74,93.5 | 74,93.5 v74,83 | 74,93.5 74,97.04 | 74,97.04 arc-90 OK2.8 | 74,97.04 74,120.96 | 74,120.96 arc-90 OK1.6 | 74,120.96 74,126.04 arc-90 OK1.8 | 9.5,72.45 9.5,63.77 | OK5.8 22.81,84.19 arc90 C1.+ | C6.1 C7.2 54.5,78 v57.5,78 | C5.2 C8.1 57,71.4 v57,72
  Top 2.5: C2.+ 44,78 v48.5,78 v57.5,78 58.5,78 | C4.+ 44,72 v48.5,72 v57,72 58,72
  Bottom 1: v73.5,67 arc90 70,70.5 66,70.5 66,75 66,78.5 arc-90 67,79.5 70.5,79.5 arc90 v74,83
  Bottom 10: 23,75 40.5,75 66,75 101,75 106,75
  Bottom 2: 23,75 17,75 arc-90 14.5,72.5 J12.2
  Bottom 2.5: 135.2,63.8 J5.1 | 131.5,68 133.15,66.13 135.2,63.8 | J6.1 135.2,50.8 133.25,52.75 | 132,54 133.25,52.75 | J7.1 135.2,33.8 133,36 | 133,36 132,37 | J8.1 135.2,20.8 134.17,22.3 | 134.17,22.3 133,24 | J4.1 135.2,91.8 | 135.2,91.8 133,94 | J3.1 135.2,104.8 133,107 arc90 123,97 123,94.5 | J2.1 135.2,118.8 133,121 131.5,121 arc90 123,112.5 | 124,121 123,120 | J1.1 135.2,131.8 132,135 | 135.2,91.8 128.3,91.8 arc90 120,83.5 111.35,78.25 | 111.35,78.25 107.91,76.16 106,75 | 135.2,63.8 arc90 135,64 125.6,64 arc-90 111.35,78.25 | 133.25,52.75 132.25,52.75 arc-90 122,63 122,55 arc90 123,54 | 133,36 131,36 arc-90 124,43 123.5,43 arc-90 123,43.5 | 134.17,22.3 131.2,22.3
  Bottom 5: 106,75 106,75.5 | 101,77.5 101,75 | 101,74.5 101,75 | 103.5,75 101,75 | 101,75 arc90 100.5,74.5 100.5,72.5 104.5,72.5 arc-90 123,54 123,43.5 123,33.47 arc90 134.17,22.3 | 132,135 arc90 123,126 123,120 123,112.5 123,94.5 123,93.5 arc-90 107,77.5 107,77.06 arc90 107.91,76.16
  Bottom 7: 40.5,75 arc-90 50,65.5 50,22
  other vias: 136,68 137,67 136,66 137,65 136,93 137,92 136,95 136,24 137,23 137,21 136,22 136,37 137,36 137,34 136,35 136,54 137,53 137,51 136,52 137,94 136,134 137,133 136,136 137,135 136,120 137,119 136,122 137,121 136,106 137,105 136,108 137,107 25.5,76 25.5,74 25.5,78.5 25.5,72 34.5,71.5 34.5,76 36.5,76 34.5,74 36.5,74 36.5,71.5 34.5,78.5 36.5,78.5 45.5,76 45.5,74 45.5,71.5 45.5,78.5 48.5,9.5 51,9.5 51,14.5 48.5,14.5 46,14.5 43.5,14.5
  pour Bottom: 7,74 6,74 arc90 5,73 5,72 5,71 arc90 6,70 24,70 arc90 27,73 27,78 arc90 25,80 21,80 arc90 16,75 arc-90 15,74
  pour Top: 132,64 arc-90 130,66 130,67 arc-90 132,69 135,69 arc-90 138,67 138,66 arc-90 135,64
  pour Top: 132,50 arc-90 130,52 130,53 arc-90 132,55 135,55 arc-90 138,53 138,52 arc-90 135,50
  pour Top: 132,33 arc-90 130,35 130,36 arc-90 132,38 135,38 arc-90 138,36 138,35 arc-90 135,33
  pour Top: 132,20 arc-90 130,22 130,23 arc-90 132,25 135,25 arc-90 138,23 138,22 arc-90 135,20
  pour Bottom: 132,64 arc-90 130,66 130,67 arc-90 132,69 135,69 arc-90 138,67 138,66 arc-90 135,64
  pour Bottom: 132,50 arc-90 130,52 130,53 arc-90 132,55 135,55 arc-90 138,53 138,52 arc-90 135,50
  pour Bottom: 132,33 arc-90 130,35 130,36 arc-90 132,38 135,38 arc-90 138,36 138,35 arc-90 135,33
  pour Bottom: 132,20 arc-90 130,22 130,23 arc-90 132,25 135,25 arc-90 138,23 138,22 arc-90 135,20
  pour Top: 132,91 arc-90 130,93 130,94 arc-90 132,96 135,96 arc-90 138,94 138,93 arc-90 135,91
  pour Top: 132,104 arc-90 130,106 130,107 arc-90 132,109 135,109 arc-90 138,107 138,106 arc-90 135,104
  pour Top: 132,118 arc-90 130,120 130,121 arc-90 132,123 135,123 arc-90 138,121 138,120 arc-90 135,118
  pour Top: 132,132 arc-90 130,134 130,135 arc-90 132,137 135,137 arc-90 138,135 138,134 arc-90 135,132
  pour Bottom: 132,132 arc-90 130,134 130,135 arc-90 132,137 135,137 arc-90 138,135 138,134 arc-90 135,132
  pour Bottom: 132,118 arc-90 130,120 130,121 arc-90 132,123 135,123 arc-90 138,121 138,120 arc-90 135,118
  pour Bottom: 132,104 arc-90 130,106 130,107 arc-90 132,109 135,109 arc-90 138,107 138,106 arc-90 135,104
  pour Bottom: 132,91 arc-90 130,93 130,94 arc-90 132,96 135,96 arc-90 138,94 138,93 arc-90 135,91
  pour Top: 25,79.5 25,70.5 46,70.5 46,79.5
  pour Bottom: 25,79.5 25,70.5 46,70.5 46,79 arc90 45.5,79.5
  pour Bottom: 42.5,20 42.5,8 arc90 44.5,6 50.5,6 arc90 53.5,8.5 53.5,21 arc90 50,24 50,26.5 48,26.5 48,25.5 arc-90 44.5,22 arc90
  pour Top: 42.5,20 42.5,8 arc90 44.5,6 50,6 arc90 53.5,8.5 53.5,21 arc90 44.5,22 arc90

### Text on the board
Top: Power Controller v1.0 | L. Cecconi